# Altium schematic sheet Power_Circuit.SchDoc (part 3 of 3)
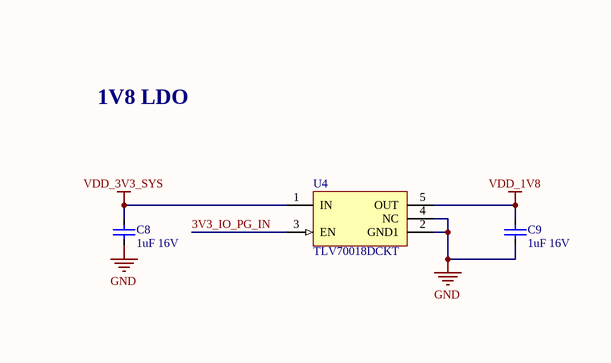
[diagram p3: Power_Circuit.SchDoc, right]

## Library data of the parts (continued)
R19 = RC0402FR-0735K7L: Res Thick Film 0402 35.7K Ohm 1% 1/16W ±100ppm/°C Molded SMD Paper T/R; Manufacturer: Yageo; Resistance: 35.7kR; Power Rating: 63mW; Voltage Rating (DC): 50V; Supplier 1: Digi-Key; Manufacturer Part Number: RC0402FR-0735K7L; RoHS: Yes; Category: Chip SMD Resistors; Stock 1: 431284; Pricing 1: 1=0.10000, 10=0.01400, 100=0.00580, 1000=0.00262, 2500=0.00228, 5000=0.00188 (USD); Case/Package: 0402; Contact Plating: Tin,Matte; Case Code (Imperial): 0402; Case Code (Metric): 1005; Min Operating Temperature: -55°C; Max Operating Temperature: 155°C; Tolerance: 1%; Packaging: Tape and Reel; Resistor Type: Thick Film; Temperature Coefficient: 100ppm/°C; Working Voltage: 50V; Number of Terminations: 2; Features: Moisture Resistant; Series: RC; Max Power Dissipation: 63mW; Construction: Rectangular; Technology: THICK FILM; Length: 1mm; Depth: 0.5mm; Military Standard: Not; Lead Free: Lead Free; RoHS Compliant: Yes; ComponentLink1URL: https://datasheet.ciiva.com/8889/pyu-rc0402-51-rohs-l-6-8889479.pdf?src-supplier=Avnet; ComponentLink1Description: https://datasheet.ciiva.com/8889/pyu-rc0402-51-rohs-l-6-8889479.pdf?src-supplier=Avnet; ComponentLink2URL: https://datasheet.ciiva.com/16740/pyu-rc0402-51-rohs-l-6-r-16740968.pdf?src-supplier=Future+Electronics; ComponentLink2Description: https://datasheet.ciiva.com/16740/pyu-rc0402-51-rohs-l-6-r-16740968.pdf?src-supplier=Future+Electronics; Supplier Part Number 1: 311-35.7KLRCT-ND
R23 = AC0603FR-0710KL: RES SMD 10K OHM 1% 1/10W 0603; Manufacturer: Yageo; Resistance: 10kR; Power Rating: 100mW; Voltage Rating: 50V; Temperature Coefficient: 100ppm/°C; Supplier 1: Digi-Key; Manufacturer Part Number: AC0603FR-0710KL; RoHS: Yes; Category: Chip SMD Resistors; Stock 1: 1821004; Pricing 1: 1=0.10000, 10=0.02500, 100=0.01030, 1000=0.00463, 2500=0.00402 (USD); Mount: Surface Mount; Case/Package: 0603; Case Code (Imperial): 0603; Case Code (Metric): 1608; Size Code: 0603; Min Operating Temperature: -55°C; Max Operating Temperature: 155°C; Tolerance: 1%; Packaging: Tape and Reel; Package Quantity: 1; Termination: SMD/SMT; Resistor Type: Thick Film; Number of Terminations: 2; Max Power Dissipation: 100mW; Features: Moisture Resistant,Automotive AEC-Q200,Anti-Sulfur; Series: AC; Construction: Rectangular; Length: 1.6mm; Width: 0.8mm; Height: 0.022inch; Depth: 0.8mm; Military Standard: Not; Lead Free: Lead Free; RoHS Compliant: Yes; ComponentLink1URL: https://datasheet.ciiva.com/26862/getdatasheetpartid-724997-26862461.pdf?src-supplier=Verical; ComponentLink1Description: https://datasheet.ciiva.com/26862/getdatasheetpartid-724997-26862461.pdf?src-supplier=Verical; Supplier Part Number 1: 311-10KLDCT-ND
R27 = RC0402FR-0740K2L: Res Thick Film 0402 40.2K Ohm 1% 0.063W(1/16W) ±100ppm/°C Pad SMD T/R; Manufacturer: Yageo; Resistance: 40.2kR; Power Rating: 62.5mW; Voltage Rating: 50V; Max Power Dissipation: 63mW; Supplier 1: Digi-Key; Manufacturer Part Number: RC0402FR-0740K2L; RoHS: Yes; Category: Chip SMD Resistors; Stock 1: 2852749; Pricing 1: 1=0.10000, 10=0.01400, 100=0.00580, 1000=0.00262, 2500=0.00228, 5000=0.00188 (USD); Case/Package: 0402; Case Code (Metric): 1005; Case Code (Imperial): 0402; Contact Plating: Tin,Matte; Size Code: 0402; Min Operating Temperature: -55°C; Max Operating Temperature: 155°C; Package Quantity: 1; Tolerance: 1%; Packaging: Tape and Reel; Resistor Type: Thick Film; Number of Terminations: 2; Termination: SMD/SMT; Temperature Coefficient: 100ppm/°C; Features: Moisture Resistant; Series: RC; Construction: Rectangular; Voltage Rating (DC): 50V; Length: 0.039inch; Width: 0.02inch; Height: 0.016inch; Depth: 0.5mm; Military Standard: Not; Lead Free: Lead Free; RoHS Compliant: Yes; ComponentLink1URL: https://datasheet.ciiva.com/2453/pyu-r-int-thick-7-2453437.pdf?src-supplier=Digi-Key; ComponentLink1Description: https://datasheet.ciiva.com/2453/pyu-r-int-thick-7-2453437.pdf?src-supplier=Digi-Key; ComponentLink2URL: https://datasheet.ciiva.com/2453/pyu-r-int-thick-7-2453438.pdf?src-supplier=Digi-Key; ComponentLink2Description: https://datasheet.ciiva.com/2453/pyu-r-int-thick-7-2453438.pdf?src-supplier=Digi-Key; ComponentLink3URL: https://datasheet.ciiva.com/2453/pyu-r-int-thick-7-2453436.pdf?src-supplier=Digi-Key; ComponentLink3Description: https://datasheet.ciiva.com/2453/pyu-r-int-thick-7-2453436.pdf?src-supplier=Digi-Key; ComponentLink4URL: https://datasheet.ciiva.com/5557/pyu-rc0402-51-rohs-l-6-r-5557981.pdf?src-supplier=Mouser; ComponentLink4Description: https://datasheet.ciiva.com/5557/pyu-rc0402-51-rohs-l-6-r-5557981.pdf?src-supplier=Mouser; ComponentLink5URL: https://datasheet.ciiva.com/8889/pyu-rc0402-51-rohs-l-6-8889263.pdf?src-supplier=Avnet; ComponentLink5Description: https://datasheet.ciiva.com/8889/pyu-rc0402-51-rohs-l-6-8889263.pdf?src-supplier=Avnet; ComponentLink6URL: https://datasheet.ciiva.com/16744/pyu-rc0402-51-rohs-l-6-r-16744286.pdf?src-supplier=Future+Electronics; ComponentLink6Description: https://datasheet.ciiva.com/16744/pyu-rc0402-51-rohs-l-6-r-16744286.pdf?src-supplier=Future+Electronics; Supplier Part Number 1: 311-40.2KLRCT-ND
R29 = RC0402FR-078K87L: Res Thick Film 0402 8.87K Ohm 1% 1/16W ±100ppm/°C Molded SMD Paper T/R; Manufacturer: Yageo; Resistance: 8.87kR; Voltage Rating (DC): 50V; Power Rating: 62.5mW; Max Power Dissipation: 63mW; Supplier 1: Digi-Key; Manufacturer Part Number: RC0402FR-078K87L; RoHS: Yes; Category: Chip SMD Resistors; Stock 1: 661203; Pricing 1: 1=0.10000, 10=0.01400, 100=0.00580, 1000=0.00262, 2500=0.00228, 5000=0.00188 (USD); Case/Package: 0402; Case Code (Imperial): 0402; Case Code (Metric): 1005; Contact Plating: Tin,Matte; Min Operating Temperature: -55°C; Max Operating Temperature: 155°C; Tolerance: 1%; Packaging: Tape and Reel; Features: Moisture Resistant; Voltage Rating: 50V; Termination: SMD/SMT; Resistor Type: Thick Film; Temperature Coefficient: 100ppm/°C; Number of Terminations: 2; Series: RC; Construction: Rectangular; Working Voltage: 50V; Technology: THICK FILM; Length: 1mm; Width: 0.5mm; Height: 0.35mm; Depth: 0.5mm; Lead Free: Lead Free; Military Standard: Not; RoHS Compliant: Yes; ComponentLink1URL: https://datasheet.ciiva.com/12575/pyu-rc0402-51-rohs-l-6-r-8721-12575212.pdf?src-supplier=Mouser; ComponentLink1Description: https://datasheet.ciiva.com/12575/pyu-rc0402-51-rohs-l-6-r-8721-12575212.pdf?src-supplier=Mouser; ComponentLink2URL: https://datasheet.ciiva.com/16743/pyu-rc0402-51-rohs-l-6-r-16743879.pdf?src-supplier=Future+Electronics; ComponentLink2Description: https://datasheet.ciiva.com/16743/pyu-rc0402-51-rohs-l-6-r-16743879.pdf?src-supplier=Future+Electronics; Supplier Part Number 1: 311-8.87KLRCT-ND
U1 U2 = TPS25944LRVCT: Hot Swap Controller 1-CH 18V N-Channel Positive Voltage 20-Pin WQFN EP T/R; Manufacturer: Texas Instruments; Min Supply Voltage: 2.7V; Number of Channels: 1; Supplier 1: Mouser; Manufacturer Part Number: TPS25944LRVCT; RoHS: Yes; Category: Power Management ICs; Stock 1: 1962; Pricing 1: 1=2.72000, 10=2.45000, 50=2.31000, 100=1.97000, 1000=1.34000, 10000=1.34000 (USD); Number of Pins: 20; Min Operating Temperature: -40°C; Max Operating Temperature: 85°C; Max Supply Voltage: 18V; Packaging: Cut Tape; Reach SVHC Compliant: Yes; Lead Free: Lead Free; RoHS Compliant: Yes; ComponentLink1URL: http://www.ti.com/general/docs/lit/getliterature.tsp?genericPartNumber=TPS25944L&&fileType=pdf&src-supplier=Farnell; ComponentLink1Description: http://www.ti.com/general/docs/lit/getliterature.tsp?genericPartNumber=TPS25944L&&fileType=pdf&src-supplier=Farnell; ComponentLink2URL: http://www.ti.com/general/docs/lit/getliterature.tsp?genericPartNumber=TPS25944L&&fileType=pdf&src-supplier=Element14; ComponentLink2Description: http://www.ti.com/general/docs/lit/getliterature.tsp?genericPartNumber=TPS25944L&&fileType=pdf&src-supplier=Element14; ComponentLink3URL: http://www.ti.com/general/docs/lit/getliterature.tsp?genericPartNumber=TPS25944L&amp;&amp;fileType=pdf&src-supplier=Farnell; ComponentLink3Description: http://www.ti.com/general/docs/lit/getliterature.tsp?genericPartNumber=TPS25944L&amp;&amp;fileType=pdf&src-supplier=Farnell; ComponentLink4URL: http://www.ti.com/lit/pdf/slvsce9?src-supplier=Digi-Key; ComponentLink4Description: http://www.ti.com/lit/pdf/slvsce9?src-supplier=Digi-Key; ComponentLink5URL: http://www.ti.com/general/docs/suppproductinfo.tsp?distId=10&amp;gotoUrl=http%3A%2F%2Fwww.ti.com%2Flit%2Fgpn%2FTPS25942A&src-supplier=Digi-Key; ComponentLink5Description: http://www.ti.com/general/docs/suppproductinfo.tsp?distId=10&amp;gotoUrl=http%3A%2F%2Fwww.ti.com%2Flit%2Fgpn%2FTPS25942A&src-supplier=Digi-Key; ComponentLink6URL: http://www.ti.com/general/docs/lit/getliterature.tsp?genericPartNumber=TPS25942L&&fileType=pdf&src-supplier=Avnet; ComponentLink6Description: http://www.ti.com/general/docs/lit/getliterature.tsp?genericPartNumber=TPS25942L&&fileType=pdf&src-supplier=Avnet; Supplier Part Number 1: 595-TPS25944LRVCT
U3 = SN74LVC1G07DCKRE4: Single 1.65-V to 5.5-V buffer with open-drain outputs 5-SC70 -40 to 125; Manufacturer: Texas Instruments; Logic Function: Buffer,Inverting; Number of Elements: 1; Max Supply Voltage: 5.5V; Min Supply Voltage: 1.65V; Propagation Delay: 4.2ns; Low Level Output Current: 32mA; Polarity: Non-Inverting; Turn-On Delay Time: 8.3ns; Quiescent Current: 10uA; Supplier 1: Digi-Key; Manufacturer Part Number: SN74LVC1G07DCKRE4; RoHS: Yes; Category: Buffers, Drivers and Transceivers; Stock 1: 1390; Pricing 1: 1=0.32000, 10=0.24000, 25=0.21000, 100=0.13590, 250=0.11248, 500=0.09000, 1000=0.06900 (USD); Mount: Surface Mount; Case/Package: SC; Number of Pins: 5; Min Operating Temperature: -40°C; Max Operating Temperature: 125°C; Packaging: Tape and Reel; Package Quantity: 1; Number of Channels: 1; Number of Inputs: 1; Number of Outputs: 1; Number of Bits per Element: 1; Number of Input Lines: 1; Number of Output Lines: 1; Number of Gates: 1; Number of Bits: 1; Series: 74LVC; Technology: CMOS; Radiation Hardening: No; Reach SVHC Compliant: Yes; Lead Free: Lead Free; RoHS Compliant: Yes; ComponentLink1URL: https://datasheet.ciiva.com/14319/sn74lvc1g07-14319317.pdf?src-supplier=Avnet; ComponentLink1Description: https://datasheet.ciiva.com/14319/sn74lvc1g07-14319317.pdf?src-supplier=Avnet; ComponentLink2URL: https://datasheet.ciiva.com/18621/sn74lvc1g07-18621567.pdf?src-supplier=Digi-Key; ComponentLink2Description: https://datasheet.ciiva.com/18621/sn74lvc1g07-18621567.pdf?src-supplier=Digi-Key; Supplier Part Number 1: 296-35936-1-ND
U4 = TLV70018DCKT: IC, LDO, 200MA, 1.8V, 5SC70; Input Voltage Min:2V; Input Voltage Max:5.5V; Output Voltage Nom.:1.8V; Output Current:200mA; Dropout Voltage Vdo:175mV; LDO Regulator Case Style:SC-70; No. of Pins:5; Operating Temperature Min:-40°C; ;RoHS Compliant: Yes; Manufacturer: Texas Instruments; Dropout Voltage: 175mV; Number of Outputs: 1; Max Power Dissipation: 320mW; Max Input Voltage: 5.5V; Min Input Voltage: 2V; Min Current Limit: 220mA; Polarity: Positive; Quiescent Current: 30uA; Accuracy: 2%; Max Supply Current: 270uA; Nominal Supply Current: 31uA; Output Type: Fixed; Power Supply Rejection Ratio (PSRR): 68dB; Supplier 1: Digi-Key; Manufacturer Part Number: TLV70018DCKT; RoHS: Yes; Category: Voltage Regulators - Linear; Stock 1: 6750; Pricing 1: 1=1.08000, 10=0.96600, 25=0.91720, 100=0.75330 (USD); Case/Package: SC; Number of Pins: 5; Contact Plating: Gold; Min Operating Temperature: -40°C; Max Operating Temperature: 125°C; Output Current: 200mA; Nominal Output Voltage: 1.8V; Packaging: Tape and Reel; Output Voltage: 1.8V; Package Quantity: 250; Max Output Current: 200mA; Number of Regulators: 1; Power Dissipation: 320mW; Min Output Voltage: 1.8V; Power Rating: 320mW; Output Voltage Accuracy: 2%; Max Output Voltage: 1.8V; Series: -; Supply Current: 31uA; Output Configuration: Positive; Length: 2.15mm; Width: 1.4mm; Height: 1mm; Radiation Hardening: No; Reach SVHC Compliant: Yes; Lead Free: Lead Free; RoHS Compliant: Yes; ComponentLink1URL: https://datasheet.ciiva.com/14149/tlv700-eng-ds-14149837.pdf?src-supplier=Distrelec; ComponentLink1Description: https://datasheet.ciiva.com/14149/tlv700-eng-ds-14149837.pdf?src-supplier=Distrelec; ComponentLink2URL: https://datasheet.ciiva.com/7992/1882059-7992894.pdf?src-supplier=Element14; ComponentLink2Description: https://datasheet.ciiva.com/7992/1882059-7992894.pdf?src-supplier=Element14; ComponentLink3URL: https://datasheet.ciiva.com/22700/1882059-22700171.pdf?src-supplier=Element14; ComponentLink3Description: https://datasheet.ciiva.com/22700/1882059-22700171.pdf?src-supplier=Element14; Supplier Part Number 1: 296-25269-1-ND
U5 = MP2384GG-Z: IC Reg Buck Adjustable 4A 11QFN; Manufacturer: Monolithic Power Systems; Output Configuration: Positive; Number of Outputs: 1; Min Input Voltage: 4.5V; Max Input Voltage: 24V; Min Output Voltage: 600mV; Max Output Voltage: 13V; Switching Frequency: 700kHz; Synchronous Rectifier: Yes; Supplier 1: Mouser; Manufacturer Part Number: MP2384GG-Z; RoHS: No; Category: Voltage Regulators - Switching; Stock 1: 14980; Pricing 1: 1=1.97000, 10=1.77000, 50=1.67000, 100=1.43000, 1000=0.96900, 10000=0.88100 (USD); Mount: Surface Mount; Case/Package: QFN; Number of Pins: 11; Min Operating Temperature: -40°C; Max Operating Temperature: 125°C; Output Type: Adjustable; Packaging: Tape and Reel; Output Current: 4A; ComponentLink1URL: https://media.digikey.com/pdf/Data%20Sheets/Monolithic%20Power%20PDFs/MP2384_r1.0.pdf?src-supplier=Digi-Key; ComponentLink1Description: https://media.digikey.com/pdf/Data%20Sheets/Monolithic%20Power%20PDFs/MP2384_r1.0.pdf?src-supplier=Digi-Key; Supplier Part Number 1: 946-MP2384GG-Z